# Altium schematic sheet lcd_wt_tr.SchDoc
size A4
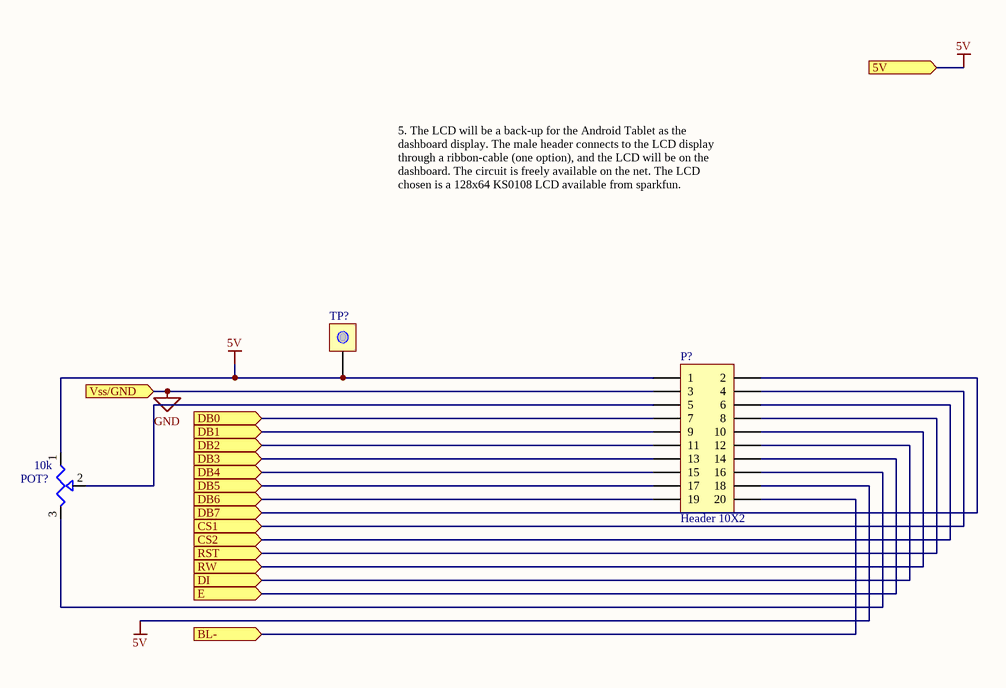
[diagram p0: lcd_wt_tr.SchDoc]

## Parts
P?  Header 10X2  [HDR2X10]
POT?  value 10k  [TC33]  (hidden comment: Trimmer)
TP?  TEST  [TESTPOINT]  (value not drawn)

## Ports
5V (in), BL- (in), CS1 (in), CS2 (in), DB0 (in), DB1 (in), DB2 (in), DB3 (in), DB4 (in), DB5 (in), DB6 (in), DB7 (in), DI (in), E (in), RST (in), RW (in), Vss/GND (in)

## Nets
5V: P?.1 P?.18 POT?.1(CCW) TP?.0(TP) ; port 5V
GND: P?.3 ; port Vss/GND
BL-: P?.20 ; port BL-
CS1: P?.4 ; port CS1
CS2: P?.6 ; port CS2
DB0: P?.7 ; port DB0
DB1: P?.9 ; port DB1
DB2: P?.11 ; port DB2
DB3: P?.13 ; port DB3
DB4: P?.15 ; port DB4
DB5: P?.17 ; port DB5
DB6: P?.19 ; port DB6
DB7: P?.2 ; port DB7
DI: P?.12 ; port DI
E: P?.14 ; port E
RST: P?.8 ; port RST
RW: P?.10 ; port RW
NetP?_5: P?.5 POT?.2(WIPER)
NetP?_16: P?.16 POT?.3(CW)

## Notes on the sheet
- 5. The LCD will be a back-up for the Android Tablet as the dashboard display. The male header connects to the LCD display through a ribbon-cable (one option), and the LCD will be on the dashboard. The circuit is freely available on the net. The LCD chosen is a 128x64 KS0108 LCD available from sparkfun.

## Library data of the parts
P? = Header 10x2: Header, 10-Pin, Dual row; LatestRevisionDate: 17-Jul-2002; LatestRevisionNote: Re-released for DXP Platform.; Publisher: Altium Limited
POT? = TC33: 3mm SMD Trimming Pot; Manufacturer: Bourns
TP? = TEST: TEST POINT